# Altium project TractiveSystem.PrjPcb
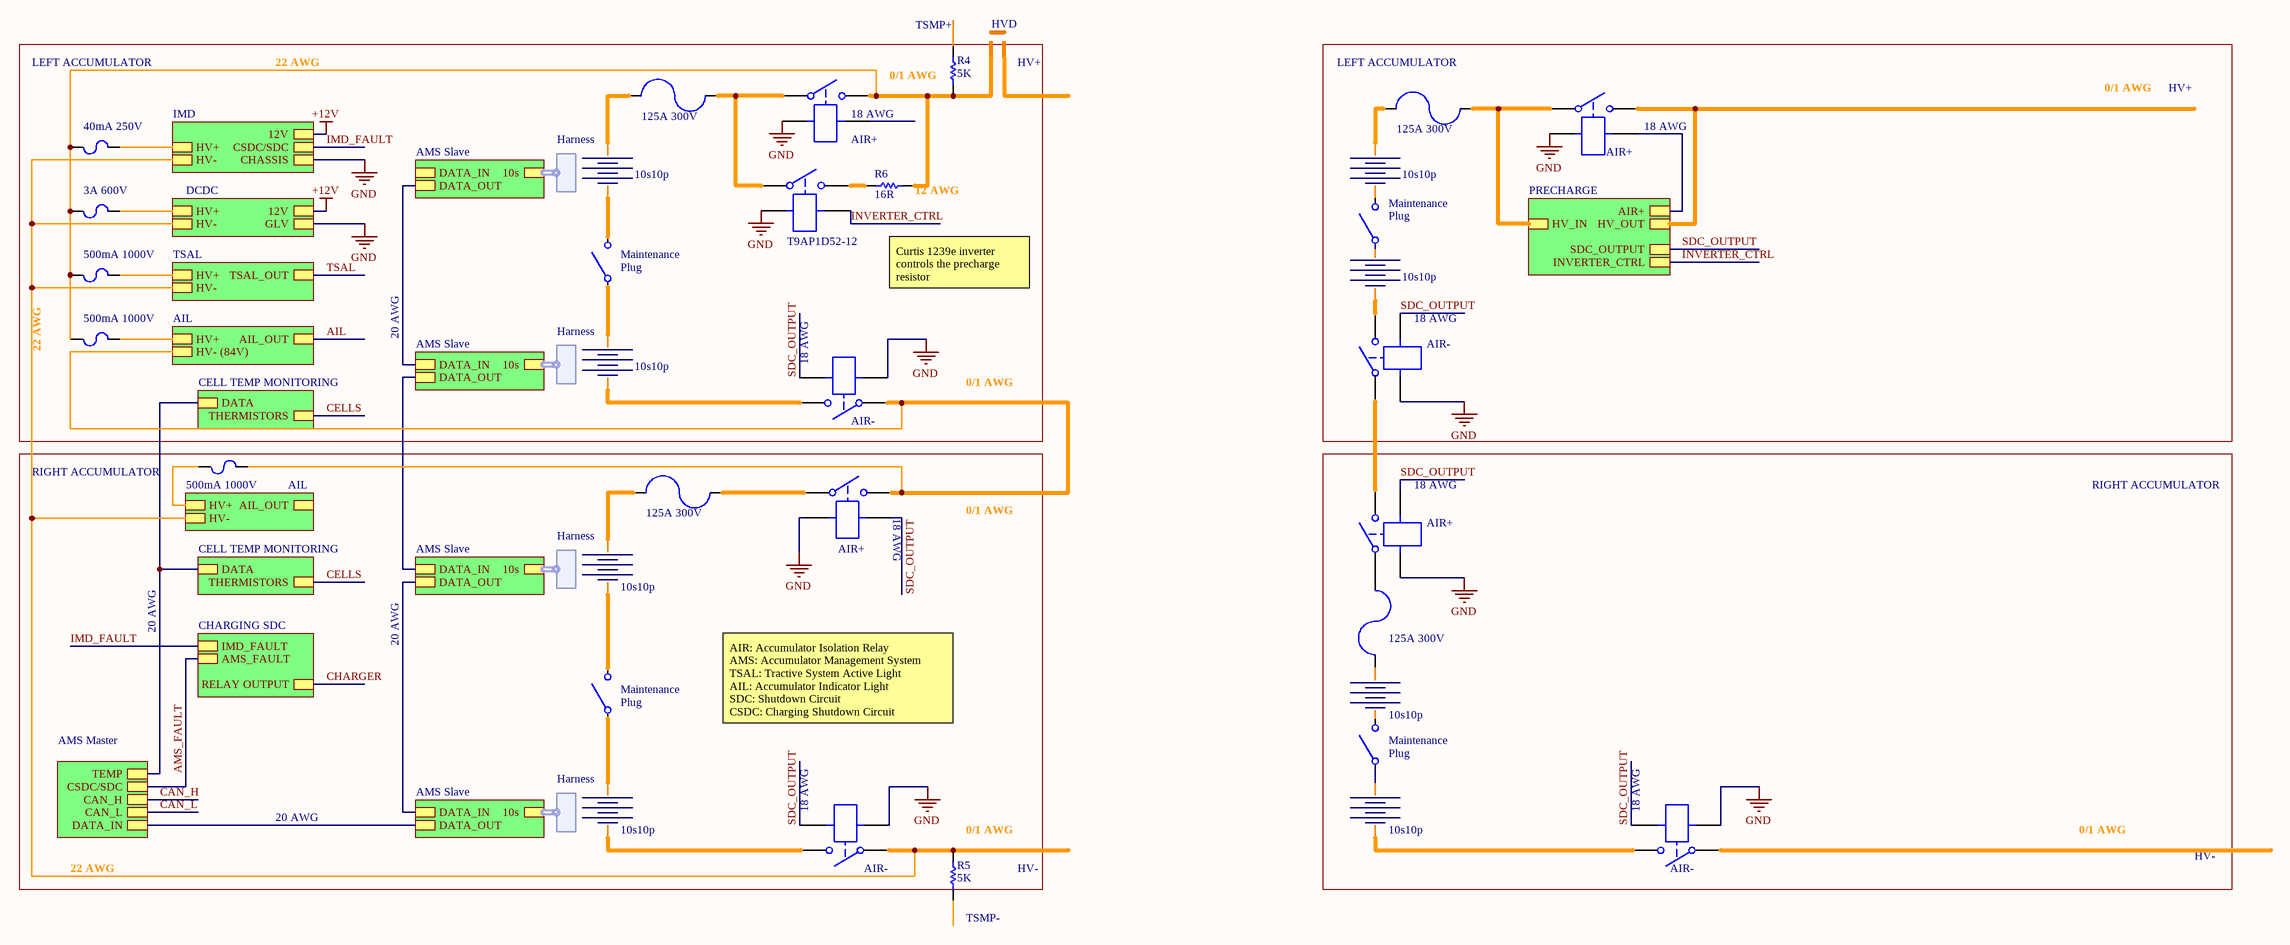
[diagram p0: Accumulator_Overview.SchDoc]
8 sheets, 70 parts. Net scope: hierarchical (ports join the sheet entries above them; power ports are global).
Sheets:
  Accumulator_Overview.SchDoc
  ChargingTS.SchDoc
  HVSystem.SchDoc
  FullSystem.SchDoc
    Designator = BatteryBoxLeft.SchDoc
    Designator = LowVoltageBox.SchDoc
    Designator = Dashboard.SchDoc
    Designator = BatteryBoxRight.SchDoc

## Sheet Accumulator_Overview.SchDoc
size A1

### Parts
(Parts that share a designator on the sheet are numbered #1, #2 ... from top to bottom, then left to right.)
1  125A 300V
2  125A 300V
3  AIR+
3A_600V  3A 600V
4  10s10p
5  125A 300V
6  AIR+
7  125A 300V
8  10s10p
9  10s10p
10s10p  10s10p
18  10s10p
19  10s10p
45  AIR-
*1  T9AP1D52-12
*2  500mA 1000V
*3  AIR+
*4  AIR-
*5  HVD
*6  AIR+
*7  AIR-
*8  AIR-
*9  40mA 250V
*10  500mA 1000V
*#1  500mA 1000V
Battery2  10s10p
Battery#1  10s10p
Plug  Maintenance_Plug  (value not drawn)
Plug1  Maintenance_Plug  (value not drawn)
Plug2  Maintenance_Plug  (value not drawn)
Plug3  Maintenance_Plug  (value not drawn)
R4  5K
R5  5K
R6  16R

### Sub-sheets
AIL = File Name (file not in this document): HV+, HV- (84V), AIL_OUT
AIL = File Name (file not in this document): HV+, HV-, AIL_OUT
AMS Master = File Name (file not in this document): CAN_H, DATA_IN, CAN_L, CSDC/SDC, TEMP
AMS Slave = File Name (file not in this document): 10s (harness Harness), DATA_OUT, DATA_IN
AMS Slave = File Name (file not in this document): 10s (harness Harness), DATA_OUT, DATA_IN
AMS Slave = File Name (file not in this document): 10s (harness Harness), DATA_OUT, DATA_IN
AMS Slave = File Name (file not in this document): 10s (harness Harness), DATA_OUT, DATA_IN
CELL TEMP MONITORING = File Name (file not in this document): THERMISTORS, DATA
CELL TEMP MONITORING = File Name (file not in this document): THERMISTORS, DATA
CHARGING SDC = File Name (file not in this document): RELAY OUTPUT, IMD_FAULT, AMS_FAULT
DCDC = File Name (file not in this document): HV+, HV-, 12V, GLV
IMD = File Name (file not in this document): HV+, HV-, 12V, CHASSIS, CSDC/SDC
PRECHARGE = File Name (file not in this document): SDC_OUTPUT, HV_IN, HV_OUT, INVERTER_CTRL, AIR+
TSAL = File Name (file not in this document): HV+, HV-, TSAL_OUT

### Harnesses
Harness: 

### Nets
+12V: sheet IMD/12V, sheet DCDC/12V
GND: 3.4 6.4 45.4 *1.4 *3.4 *4.4 *6.4 *7.4 *8.4 ; sheet IMD/CHASSIS, sheet DCDC/GLV
AIL: sheet AIL/AIL_OUT
AMS_FAULT: sheet AMS Master/CSDC/SDC, sheet CHARGING SDC/AMS_FAULT
CAN_H: sheet AMS Master/CAN_H
CAN_L: sheet AMS Master/CAN_L
CELLS: sheet CELL TEMP MONITORING/THERMISTORS, sheet CELL TEMP MONITORING/THERMISTORS
CHARGER: sheet CHARGING SDC/RELAY OUTPUT
IMD_FAULT: sheet IMD/CSDC/SDC, sheet CHARGING SDC/IMD_FAULT
INVERTER_CTRL: *1.4 ; sheet PRECHARGE/INVERTER_CTRL
SDC_OUTPUT: 3.4 6.4 45.4 *4.4 *7.4 *8.4 ; sheet PRECHARGE/SDC_OUTPUT
TSAL: sheet TSAL/TSAL_OUT
Net1_1: 1.1 Battery#1.1
Net1_2: 1.2 *1.4 *3.4
Net2_1: 2.1 Battery2.1
Net2_2: 2.2 *6.4 ; sheet PRECHARGE/HV_IN
Net3_4: 3.4 5.2
Net3_4: 3.4 45.4 *10.2 ; sheet AIL/HV- (84V)  [a separate net that carries the same name]
Net3A_600V_1: 3A_600V.1 *2.1 *3.4 *9.1 *#1.1 R4.1 R6.1
Net3A_600V_2: 3A_600V.2 ; sheet DCDC/HV+
Net4_1: 4.1 Plug2.4
Net4_2: 4.2 *7.4
Net5_1: 5.1 10s10p.1
Net6_4: 6.4 7.2
Net6_4: 6.4 *7.4  [a separate net that carries the same name]
Net7_1: 7.1 8.1
Net9_1: 9.1 Plug3.4
Net9_2: 9.2 *8.4
Net10s10p_2: 10s10p.2 Plug.4
Net18_1: 18.1 Plug.4
Net18_2: 18.2 *4.4
Net19_1: 19.1 Plug1.4
Net19_2: 19.2 45.4
Net*2_2: *2.2 ; sheet AIL/HV+
Net*4_4: *4.4 R5.2 ; sheet IMD/HV-, sheet DCDC/HV-, sheet TSAL/HV-, sheet AIL/HV-
Net*6_4: *6.4 ; sheet PRECHARGE/HV_OUT
Net*6_4: *6.4 ; sheet PRECHARGE/AIR+  [a separate net that carries the same name]
Net*9_2: *9.2 ; sheet IMD/HV+
Net*10_1: *10.1 ; sheet AIL/HV+
Net*#1_2: *#1.2 ; sheet TSAL/HV+
NetBattery2_2: Battery2.2 Plug2.4
NetBattery#1_2: Battery#1.2 Plug1.4
(unnamed): sheet AMS Master/DATA_IN, sheet AMS Slave/DATA_OUT
(unnamed): sheet AMS Master/TEMP, sheet CELL TEMP MONITORING/DATA, sheet CELL TEMP MONITORING/DATA
(unnamed): sheet AMS Slave/DATA_IN, sheet AMS Slave/DATA_OUT
(unnamed): sheet AMS Slave/DATA_IN, sheet AMS Slave/DATA_OUT
(unnamed): sheet AMS Slave/DATA_IN, sheet AMS Slave/DATA_OUT

Not connected (* = marked no-connect by the designer): 8 2; R4 2; R5 1; R6 2

### Notes on the sheet
- LEFT ACCUMULATOR
- 22 AWG
- (near R4) 0/1 AWG
- (near R4) TSMP+
- (near *5) HV+
- (near 2) LEFT ACCUMULATOR
- (near *3) 18 AWG
- (near *6) 18 AWG
- 0/1 AWG
- HV+
- (near R6) 12 AWG
- Maintenance
- (near Plug1) Maintenance
- (near Plug1) Plug
- (near Plug2) Plug
- 20 AWG
- Curtis 1239e inverter controls the precharge resistor
- (near *7) 18 AWG
- (near 45) 18 AWG
- RIGHT ACCUMULATOR
- (near 3) 18 AWG
- (near 6) 18 AWG
- (near Plug) Maintenance
- (near Plug) Plug
- AIR: Accumulator Isolation Relay
  AMS: Accumulator Management System
  TSAL: Tractive System Active Light
  AIL: Accumulator Indicator Light
  SDC: Shutdown Circuit
  CSDC: Charging Shutdown Circuit
- (near Plug3) Maintenance
- (near Plug3) Plug
- (near *4) 18 AWG
- (near R5) 0/1 AWG
- (near *8) 18 AWG
- HV-
- (near R5) TSMP-

### Library data of the parts
1 2 5 7 = FUSE
3 6 45 *1 *3 *4 *6-*8 = AIR_Detailed
3A_600V *2 *9 *10 *#1 = FUSE_MINI
4 8 9 10s10p 18 19 Battery2 Battery#1 = Battery
R4-R6 = RES

## Sheet ChargingTS.SchDoc
size A4
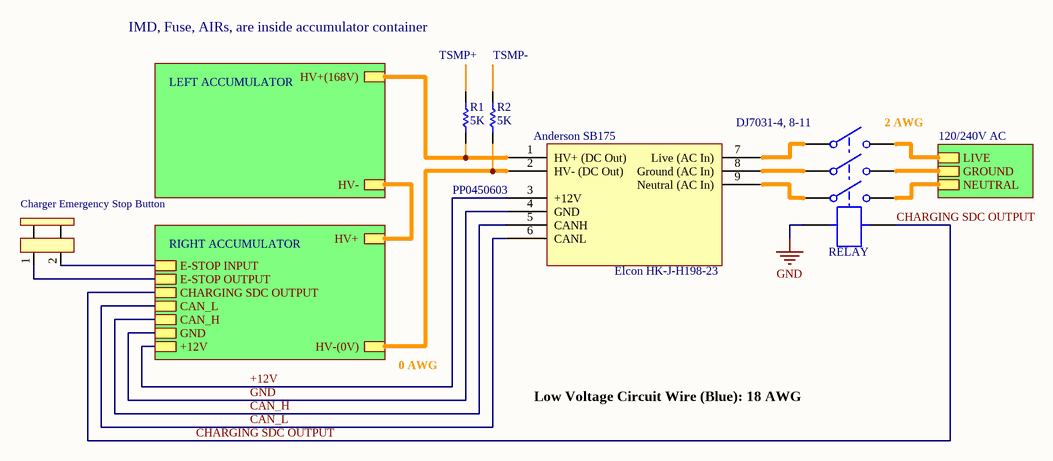
[diagram p1: ChargingTS.SchDoc]

### Parts
(Parts that share a designator on the sheet are numbered #1, #2 ... from top to bottom, then left to right.)
11  RELAY
*#2  SDCbutton  (value not drawn)
?#1  Elcon HK-J-H198-23
R1#1  5K
R2#1  5K

### Sub-sheets
LEFT ACCUMULATOR = File Name (file not in this document): HV+(168V), HV-
RIGHT ACCUMULATOR = File Name (file not in this document): CAN_H, CAN_L, HV-(0V), HV+, +12V, GND, CHARGING SDC OUTPUT, E-STOP INPUT, E-STOP OUTPUT
? = 120/240V AC (file not in this document): LIVE, GROUND, NEUTRAL

### Nets
GND: 11.4 ?#1.4(GND) ; sheet RIGHT ACCUMULATOR/GND
+12V: ?#1.3(+12V) ; sheet RIGHT ACCUMULATOR/+12V
CAN_H: ?#1.5(CANH) ; sheet RIGHT ACCUMULATOR/CAN_H
CAN_L: ?#1.6(CANL) ; sheet RIGHT ACCUMULATOR/CAN_L
CHARGING SDC OUTPUT: 11.4 ; sheet RIGHT ACCUMULATOR/CHARGING SDC OUTPUT
Net11_4: 11.4 ?#1.7(Live_(AC_In))
Net11_4: 11.4 ?#1.8(Ground_(AC_In))  [a separate net that carries the same name]
Net11_4: 11.4 ?#1.9(Neutral_(AC_In))  [a separate net that carries the same name]
Net11_4: 11.4 ; sheet /NEUTRAL  [a separate net that carries the same name]
Net11_4: 11.4 ; sheet /GROUND  [a separate net that carries the same name]
Net11_4: 11.4 ; sheet /LIVE  [a separate net that carries the same name]
Net*#2_1: *#2.1 ; sheet RIGHT ACCUMULATOR/E-STOP OUTPUT
Net*#2_2: *#2.2 ; sheet RIGHT ACCUMULATOR/E-STOP INPUT
Net?#1_1: ?#1.1(HV+_(DC_Out)) R1#1.1 ; sheet LEFT ACCUMULATOR/HV+(168V)
Net?#1_2: ?#1.2(HV-_(DC_Out)) R2#1.1 ; sheet RIGHT ACCUMULATOR/HV-(0V)
(unnamed): sheet LEFT ACCUMULATOR/HV-, sheet RIGHT ACCUMULATOR/HV+

Not connected (* = marked no-connect by the designer): R1#1 2; R2#1 2

### Notes on the sheet
- IMD, Fuse, AIRs, are inside accumulator container
- TSMP+
- TSMP-
- (near R2#1) Anderson SB175
- (near 11) DJ7031-4, 8-11
- (near 11) 2 AWG
- PP0450603
- 0 AWG
- Low Voltage Circuit Wire (Blue): 18 AWG
- (in symbol SDCbutton) Charger Emergency Stop Button

### Library data of the parts
?#1 = Charger
R1#1 R2#1 = RES

## Sheet HVSystem.SchDoc
size A4
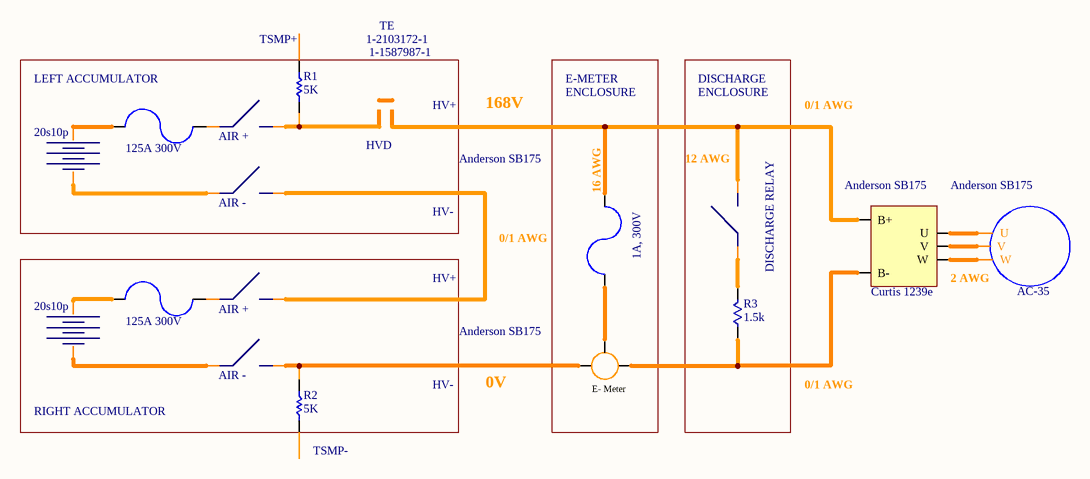
[diagram p2: HVSystem.SchDoc]

### Parts
(Parts that share a designator on the sheet are numbered #1, #2 ... from top to bottom, then left to right.)
125A_300V  125A 300V
*#3  HVD
?#2  1A, 300V
?#3  125A 300V
AIR+  AIR +
AIR+1  AIR -
AIR+2  DISCHARGE RELAY
AIR-  AIR -
AIR-1  AIR +
battery1  20s10p
battery#2  20s10p
inverter  Curtis 1239e
meter  E-meter  (value not drawn)
motor  AC-35
R1#2  5K
R2#2  5K
R3  1.5k

### Nets
Net125A_300V_1: 125A_300V.1 battery#2.1
Net125A_300V_2: 125A_300V.2 AIR+.1
Net?#2_1: ?#2.1 meter.?3
Net?#2_2: ?#2.2 AIR+2.2 inverter.2(B+)
Net?#3_1: ?#3.1 battery1.1
Net?#3_2: ?#3.2 AIR-1.1
NetAIR+1_1: AIR+1.1 battery#2.2
NetAIR+1_2: AIR+1.2 AIR-1.2
NetAIR+2_1: AIR+2.1 R3.2
NetAIR+_2: AIR+.2 R1#2.1
NetAIR-_1: AIR-.1 battery1.2
NetAIR-_2: AIR-.2 meter.?1 R2#2.2
Netinverter_1: inverter.1(B-) meter.?2 R3.1
Netinverter_3: inverter.3(U) motor.3(U)
Netinverter_4: inverter.4(V) motor.4(V)
Netinverter_5: inverter.5(W) motor.5(W)

Not connected (* = marked no-connect by the designer): R1#2 2; R2#2 1

### Notes on the sheet
- (near R1#2) TSMP+
- 1-2103172-1
- (near *#3) 1-1587987-1
- TE
- LEFT ACCUMULATOR
- (near *#3) HV+
- 168V
- E-METER
- ENCLOSURE
- DISCHARGE
- 0/1 AWG
- Anderson SB175
- (near ?#2) 16 AWG
- (near AIR+2) 12 AWG
- (near inverter) Anderson SB175
- HV-
- HV+
- (near meter) Anderson SB175
- 2 AWG
- RIGHT ACCUMULATOR
- 0V
- (near R2#2) TSMP-
- (in symbol E-meter) E- Meter /

### Library data of the parts
125A_300V ?#2 ?#3 = FUSE
AIR+ AIR+1 AIR+2 AIR- AIR-1 = AIR
battery1 battery#2 = Battery
inverter = Inverter
motor = Motor
R1#2 R2#2 = RES
R3 = Resistor

## Sheet FullSystem.SchDoc
size A1
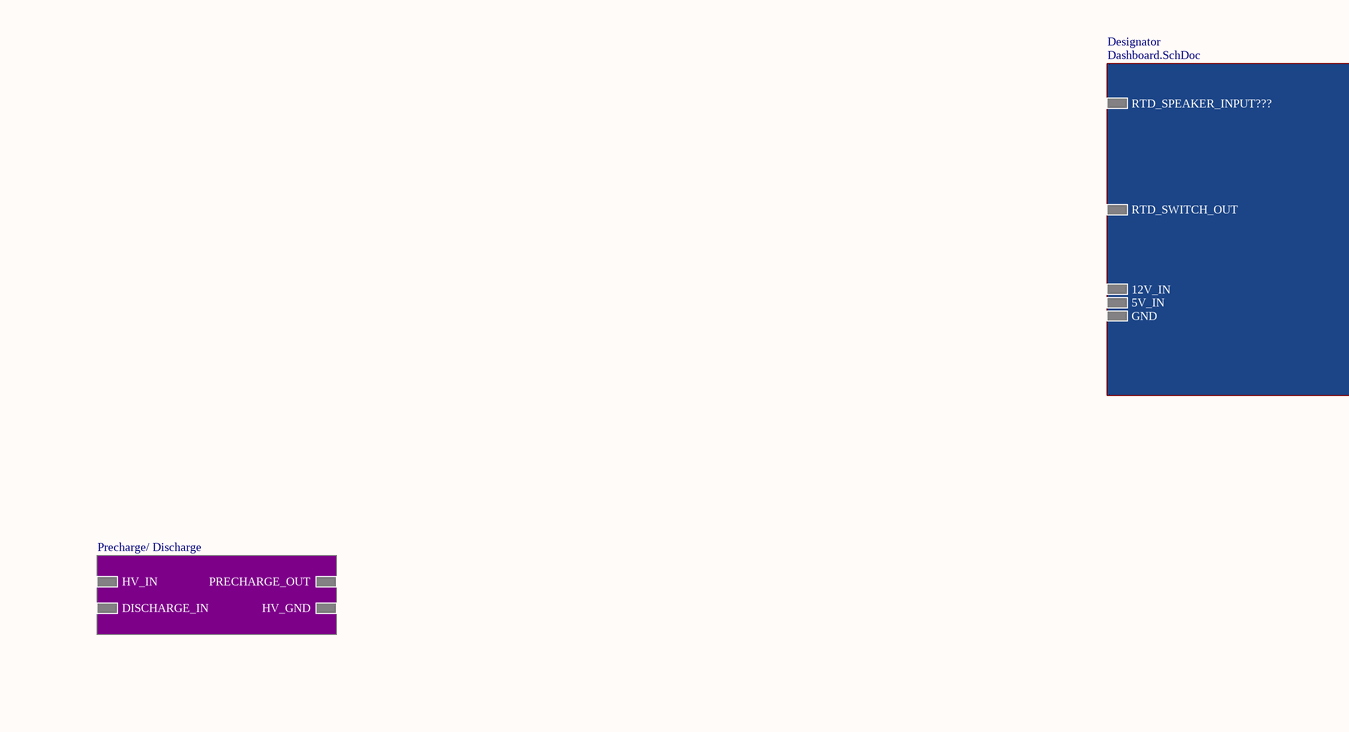
[diagram p3: FullSystem.SchDoc, top left]
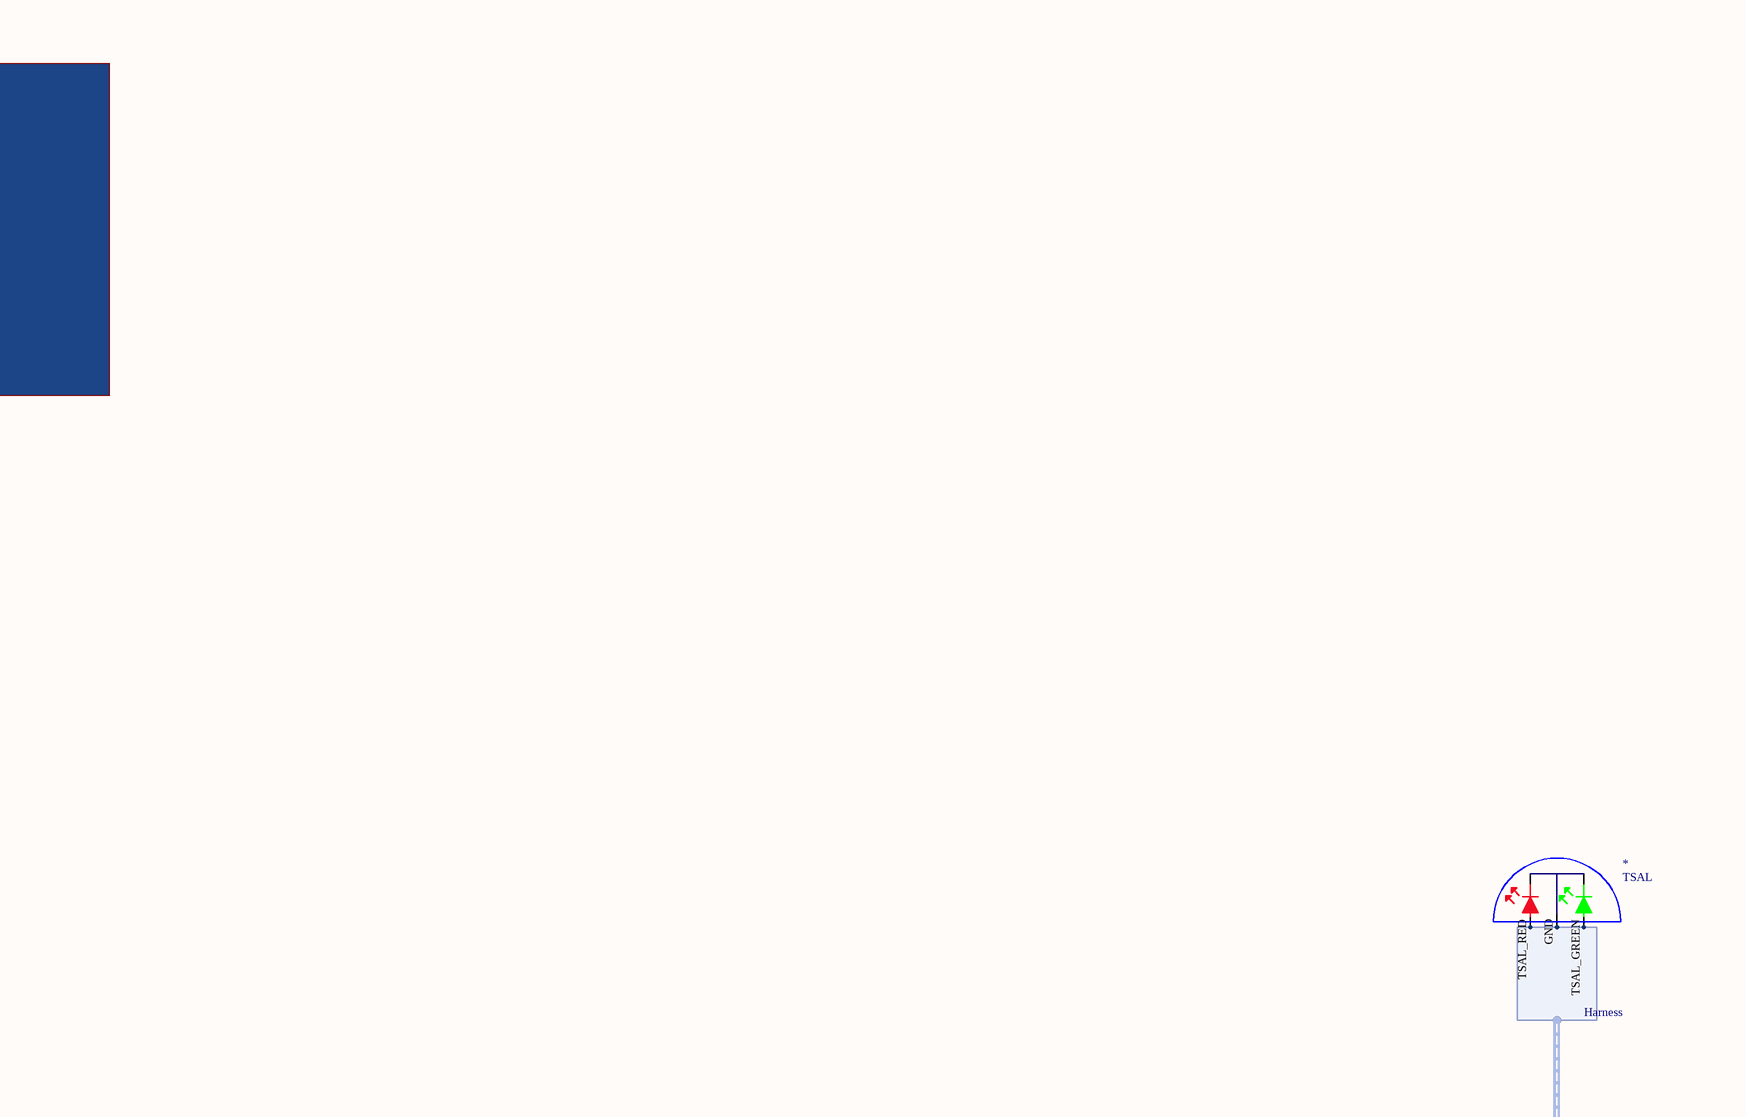
[diagram p4: FullSystem.SchDoc, top right]
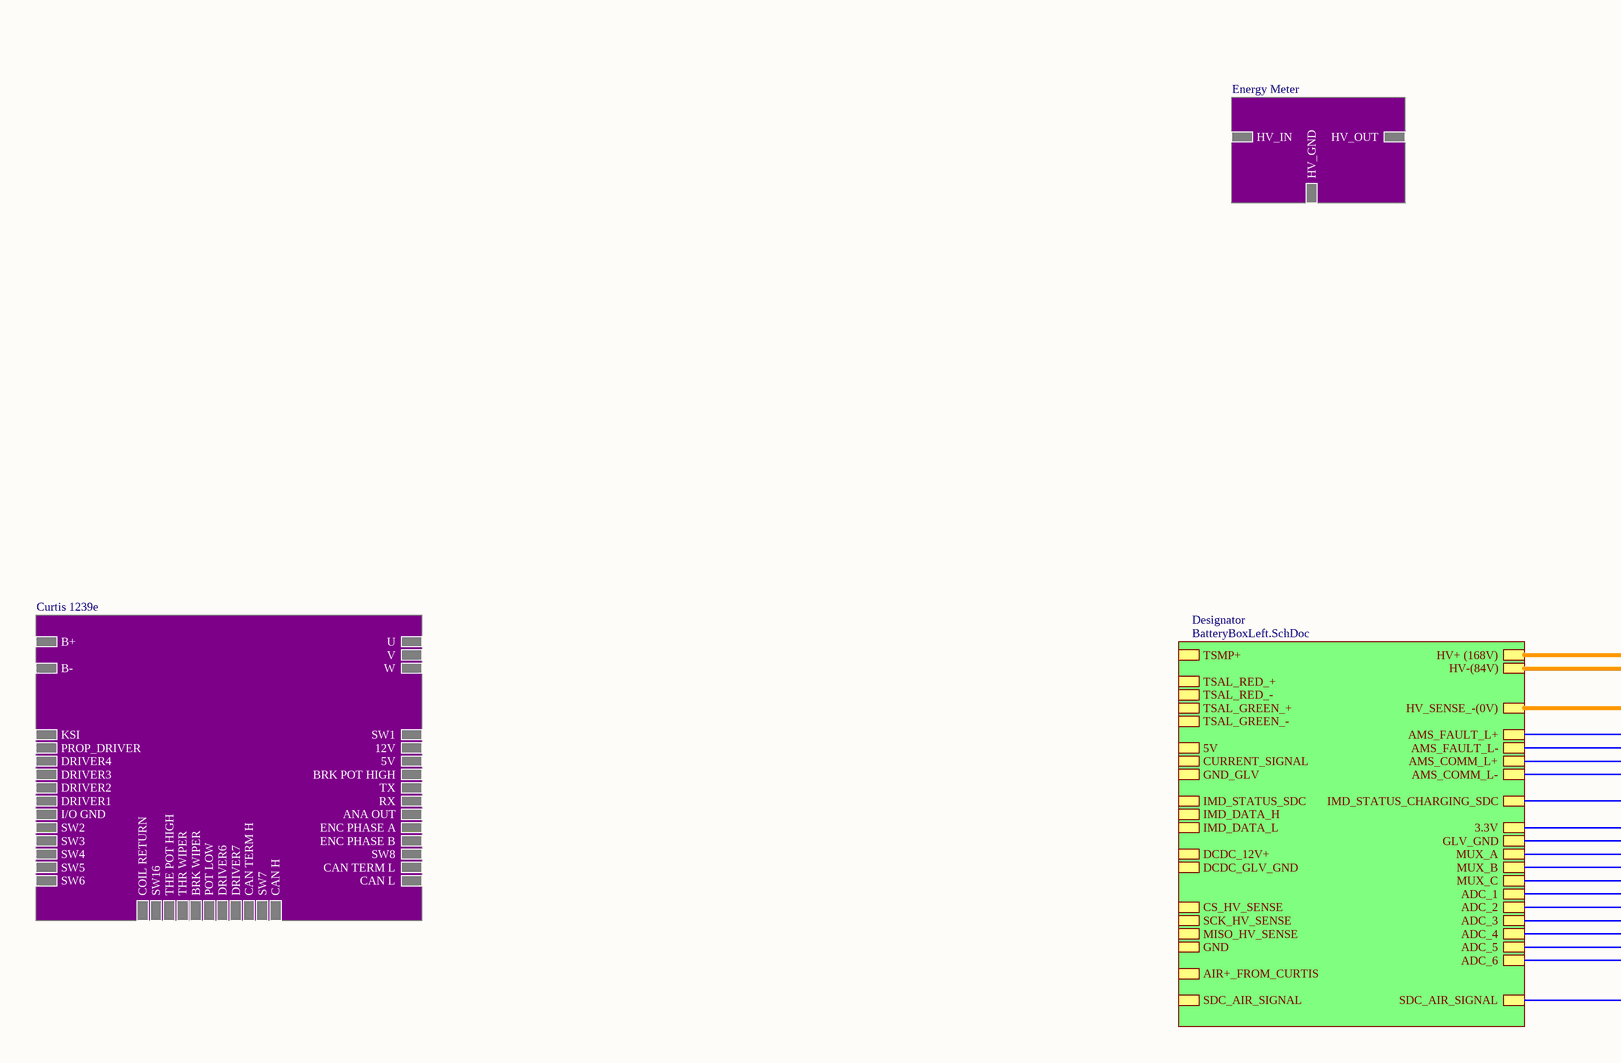
[diagram p5: FullSystem.SchDoc, bottom left]
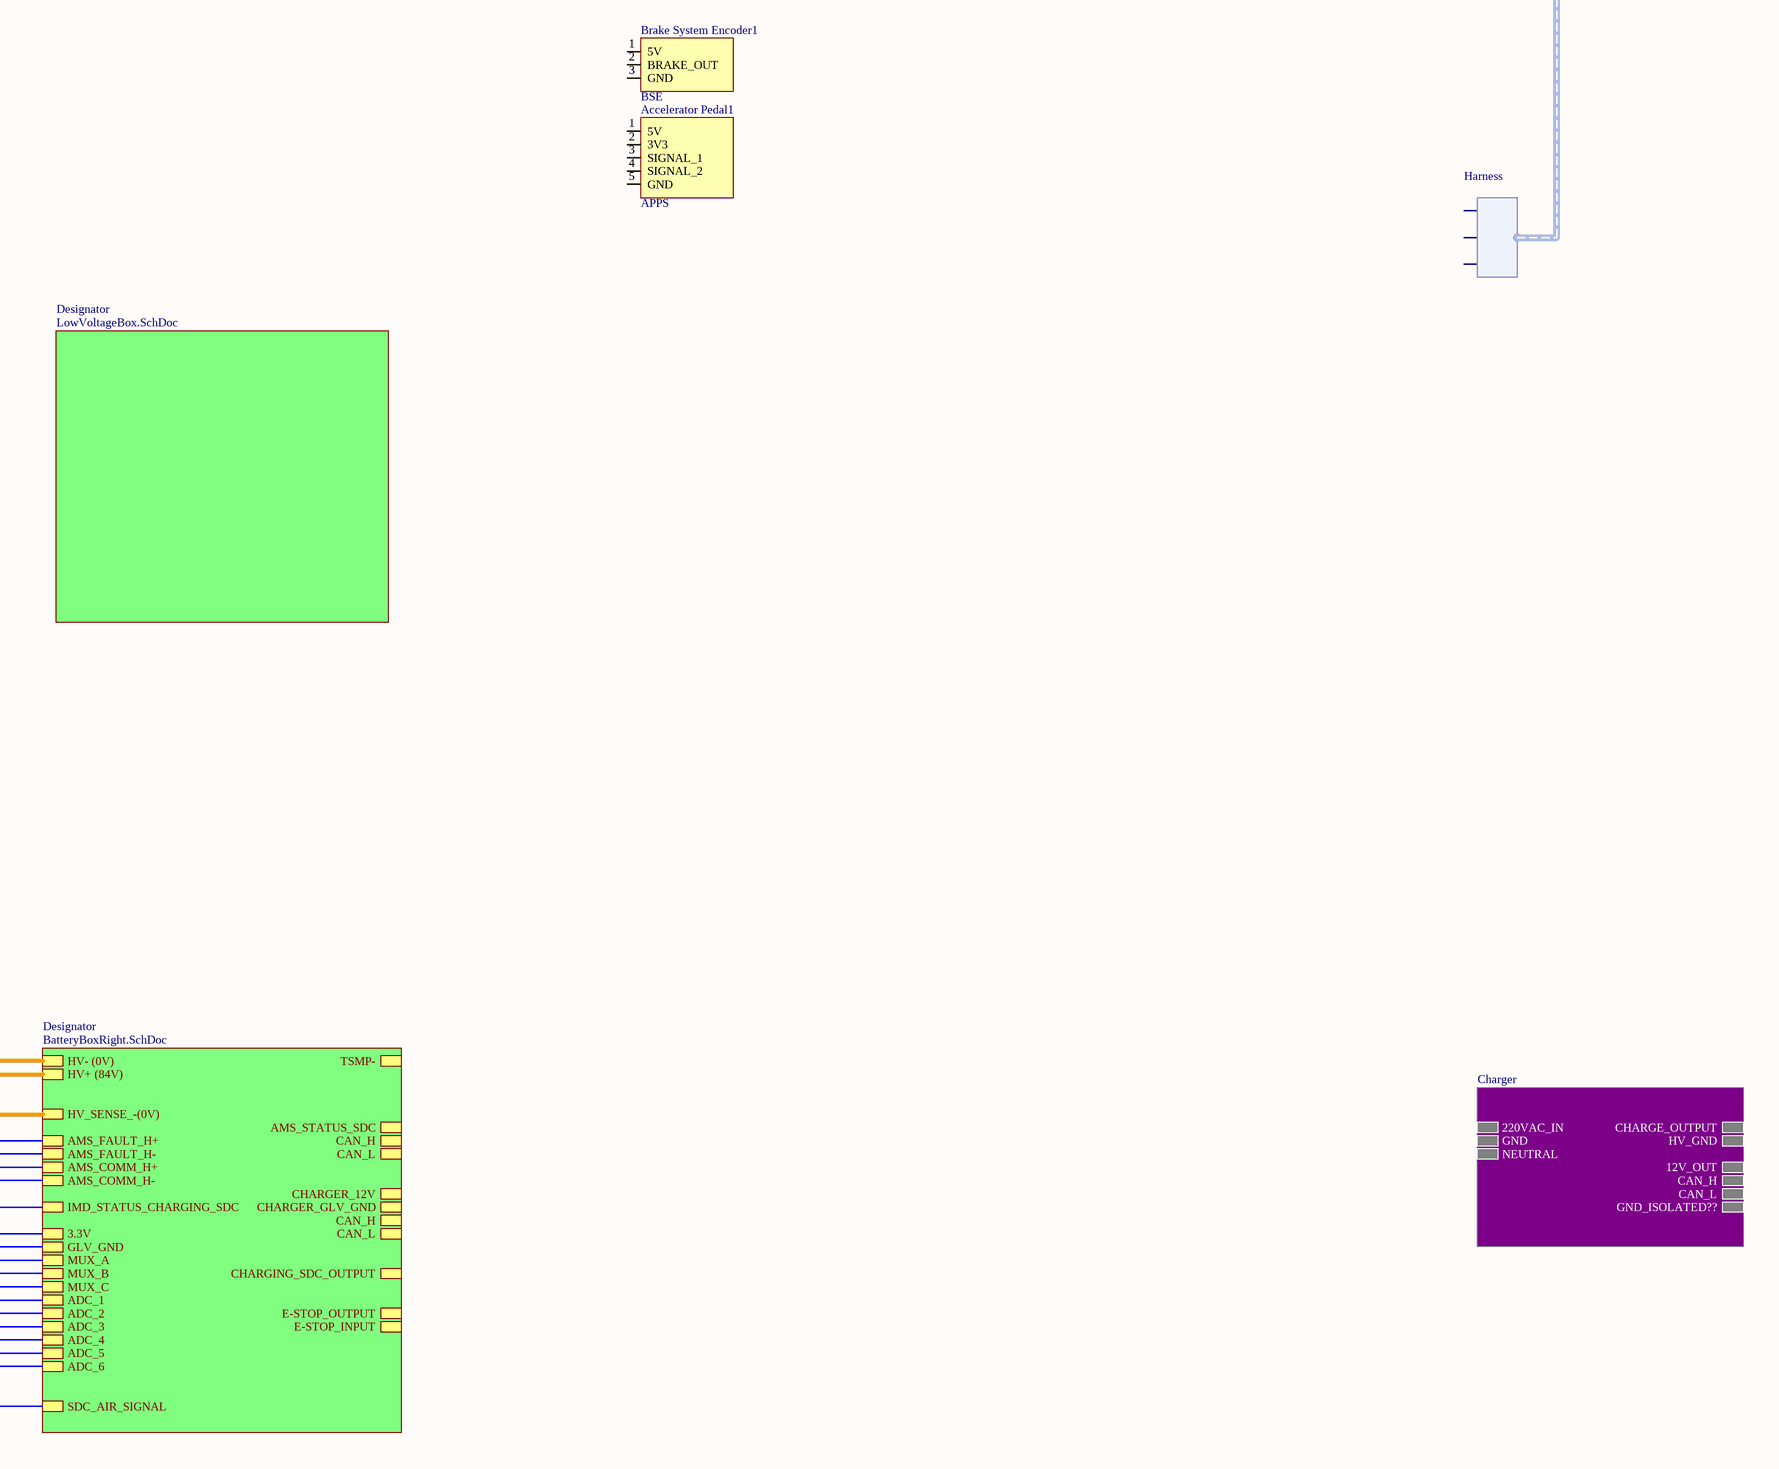
[diagram p6: FullSystem.SchDoc, bottom right]

### Parts
(Parts that share a designator on the sheet are numbered #1, #2 ... from top to bottom, then left to right.)
*#4  TSAL
Accelerator_Pedal1  APPS
Brake_System_Encoder1  BSE

### Sub-sheets
Charger = ?: 220VAC_IN, NEUTRAL, CHARGE_OUTPUT, 12V_OUT, CAN_H, CAN_L, GND_ISOLATED??, HV_GND, GND
Curtis 1239e = ?: B+, B-, U, V, W, DRIVER4, DRIVER3, DRIVER2, DRIVER1, I/O GND, SW2, SW3, SW4, SW5, SW6, COIL RETURN, SW16, THE POT HIGH, THR WIPER, BRK WIPER, POT LOW, DRIVER6, DRIVER7, CAN TERM H, SW7, CAN H, BRK POT HIGH, SW8, ENC PHASE B, ENC PHASE A, ANA OUT, RX, TX, 5V, PROP_DRIVER, 12V, KSI, SW1, CAN TERM L, CAN L
Designator = BatteryBoxLeft.SchDoc: HV+ (168V), HV-(84V), AMS_FAULT_L+, AMS_FAULT_L-, AMS_COMM_L+, AMS_COMM_L-, 3.3V, GLV_GND, MUX_A, MUX_B, MUX_C, ADC_1, ADC_2, ADC_3, ADC_4, ADC_5, ADC_6, 5V, CURRENT_SIGNAL, GND_GLV, IMD_STATUS_SDC, IMD_DATA_H, IMD_DATA_L, DCDC_12V+, DCDC_GLV_GND, TSMP+, IMD_STATUS_CHARGING_SDC, MISO_HV_SENSE, SCK_HV_SENSE, CS_HV_SENSE, HV_SENSE_-(0V), SDC_AIR_SIGNAL, SDC_AIR_SIGNAL, AIR+_FROM_CURTIS, TSAL_RED_+, TSAL_RED_-, TSAL_GREEN_+, TSAL_GREEN_-, GND
Designator = LowVoltageBox.SchDoc: no entries
Designator = Dashboard.SchDoc: RTD_SPEAKER_INPUT???, RTD_SWITCH_OUT, 12V_IN, 5V_IN, GND
Designator = BatteryBoxRight.SchDoc: HV- (0V), HV+ (84V), AMS_FAULT_H+, AMS_FAULT_H-, AMS_COMM_H+, AMS_COMM_H-, CAN_H, CAN_L, 3.3V, GLV_GND, MUX_A, MUX_B, MUX_C, ADC_1, ADC_2, ADC_3, ADC_4, ADC_5, ADC_6, TSMP-, IMD_STATUS_CHARGING_SDC, HV_SENSE_-(0V), CHARGER_12V, CHARGER_GLV_GND, CHARGING_SDC_OUTPUT, AMS_STATUS_SDC, SDC_AIR_SIGNAL, E-STOP_INPUT, E-STOP_OUTPUT, CAN_H, CAN_L
Energy Meter = ?: HV_IN, HV_GND, HV_OUT
Precharge/ Discharge = ?: HV_IN, DISCHARGE_IN, PRECHARGE_OUT, HV_GND

### Harnesses
Harness: , , 
Harness: 

### Nets
Net*#4_GND: *#4.GND *#4.TSAL_GREEN *#4.TSAL_RED ; harness Harness.
(unnamed): sheet Designator/HV-(84V), sheet Designator/HV+ (84V)
(unnamed): sheet Designator/AMS_FAULT_L+, sheet Designator/AMS_FAULT_H+
(unnamed): sheet Designator/AMS_FAULT_L-, sheet Designator/AMS_FAULT_H-
(unnamed): sheet Designator/AMS_COMM_L+, sheet Designator/AMS_COMM_H+
(unnamed): sheet Designator/AMS_COMM_L-, sheet Designator/AMS_COMM_H-
(unnamed): sheet Designator/3.3V, sheet Designator/3.3V
(unnamed): sheet Designator/GLV_GND, sheet Designator/GLV_GND
(unnamed): sheet Designator/MUX_A, sheet Designator/MUX_A
(unnamed): sheet Designator/MUX_B, sheet Designator/MUX_B
(unnamed): sheet Designator/MUX_C, sheet Designator/MUX_C
(unnamed): sheet Designator/ADC_1, sheet Designator/ADC_1
(unnamed): sheet Designator/ADC_2, sheet Designator/ADC_2
(unnamed): sheet Designator/ADC_3, sheet Designator/ADC_3
(unnamed): sheet Designator/ADC_4, sheet Designator/ADC_4
(unnamed): sheet Designator/ADC_5, sheet Designator/ADC_5
(unnamed): sheet Designator/ADC_6, sheet Designator/ADC_6
(unnamed): sheet Designator/IMD_STATUS_CHARGING_SDC, sheet Designator/IMD_STATUS_CHARGING_SDC
(unnamed): sheet Designator/HV_SENSE_-(0V), sheet Designator/HV_SENSE_-(0V)
(unnamed): sheet Designator/SDC_AIR_SIGNAL, sheet Designator/SDC_AIR_SIGNAL, sheet Designator/SDC_AIR_SIGNAL
(unnamed): sheet Designator/CAN_H, sheet Designator/CAN_H
(unnamed): sheet Designator/CAN_L, sheet Designator/CAN_L

Not connected (* = marked no-connect by the designer): *#4 2; Accelerator_Pedal1 1(5V) 2(3V3) 3(SIGNAL_1) 4(SIGNAL_2) 5(GND); Brake_System_Encoder1 1(5V) 2(BRAKE_OUT) 3(GND)

## Sheet BatteryBoxLeft.SchDoc
size A1
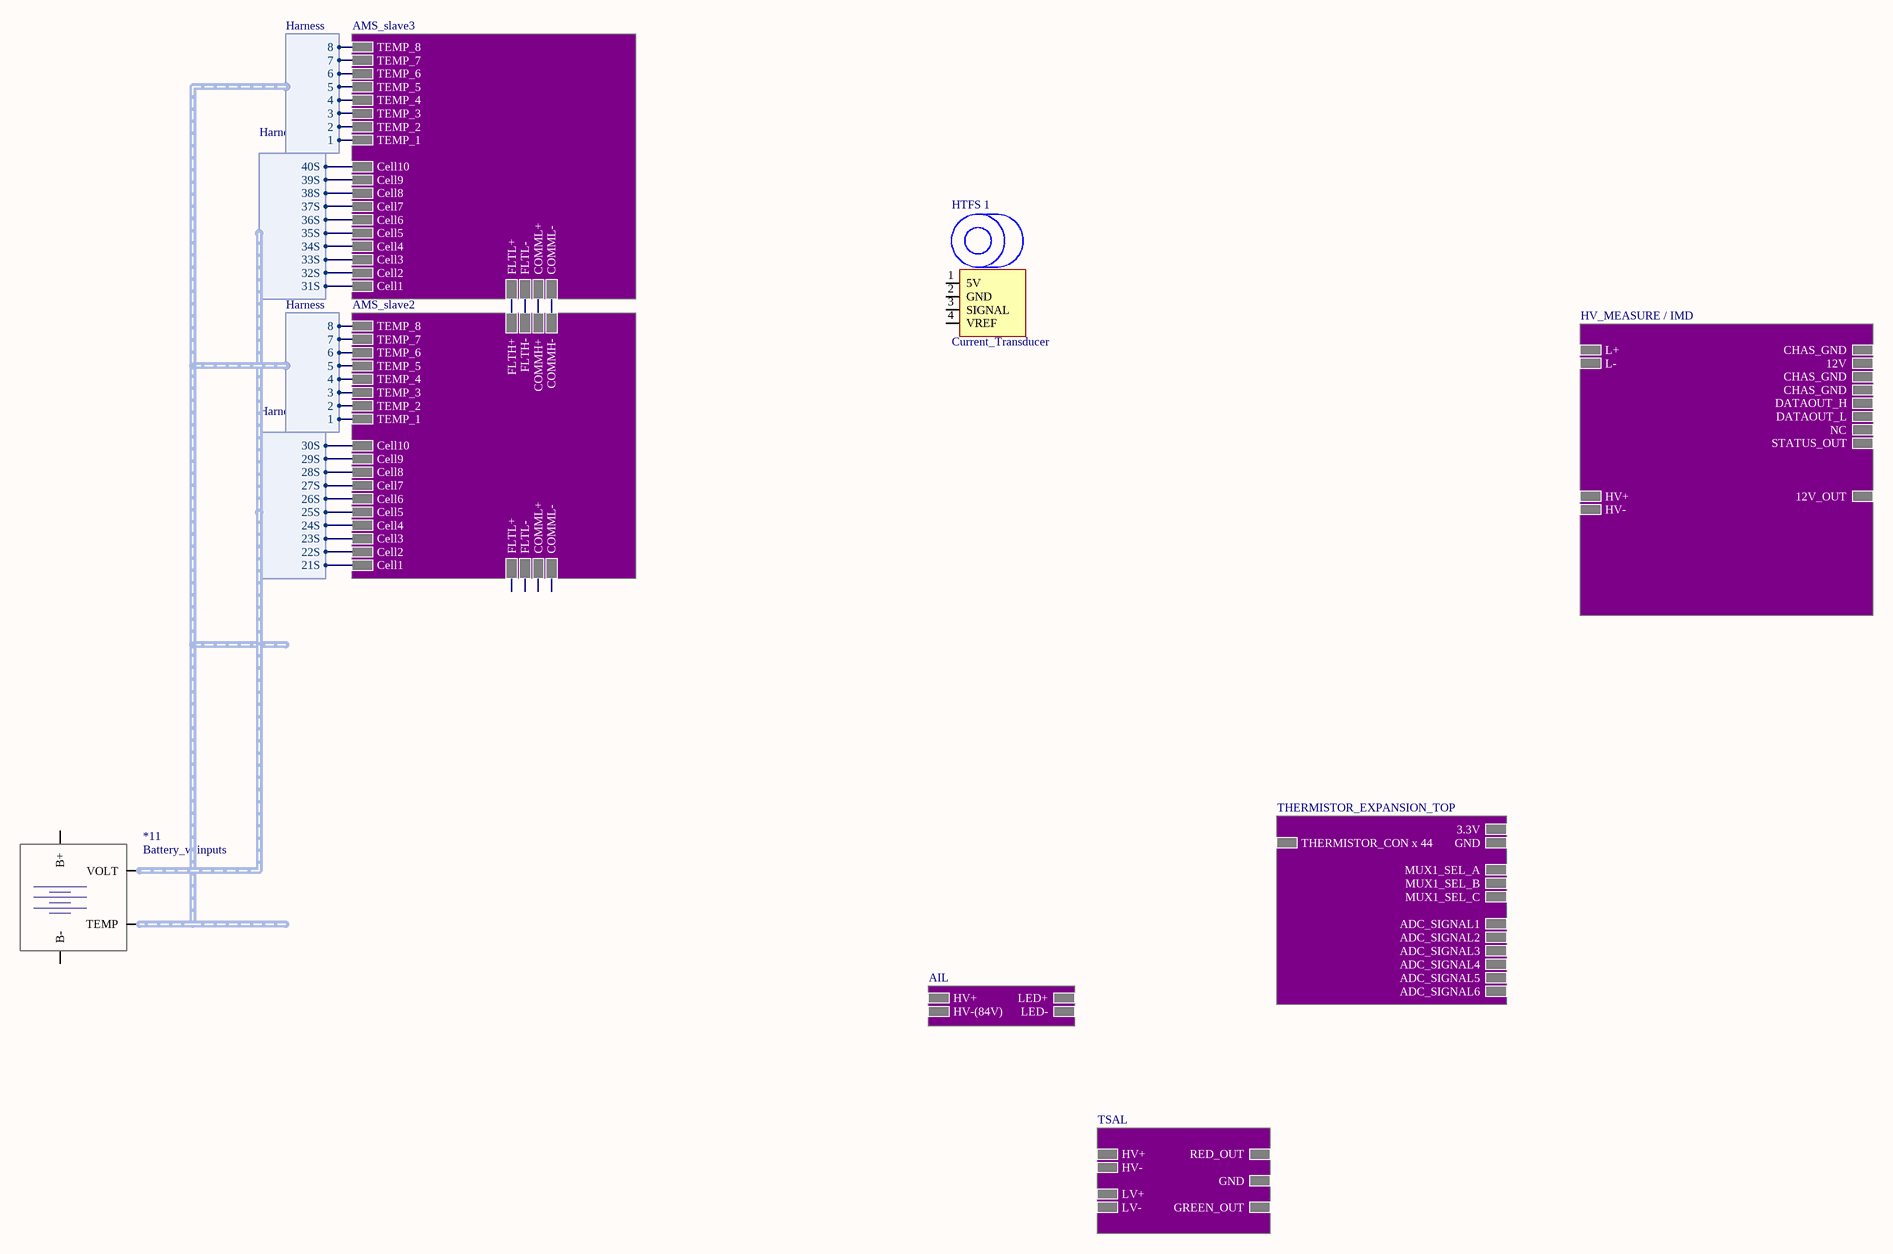
[diagram p7: BatteryBoxLeft.SchDoc]

### Parts
*11  Battery_w/inputs
HTFS_1  Current_Transducer

### Sub-sheets
AIL = ?: HV+, HV-(84V), LED+, LED-
AMS_slave2 = ?: Cell10, Cell9, Cell8, Cell7, Cell6, Cell5, Cell4, Cell3, Cell2, Cell1, FLTH+, FLTH-, COMMH+, COMMH-, FLTL+, FLTL-, COMML+, COMML-, TEMP_1, TEMP_3, TEMP_4, TEMP_5, TEMP_6, TEMP_7, TEMP_8, TEMP_2
AMS_slave3 = ?: Cell10, Cell9, Cell8, Cell7, Cell6, Cell5, Cell4, Cell3, Cell2, Cell1, FLTL+, FLTL-, COMML+, COMML-, TEMP_1, TEMP_3, TEMP_4, TEMP_5, TEMP_6, TEMP_7, TEMP_8, TEMP_2
HV_MEASURE / IMD = ?: L+, L-, CHAS_GND, 12V, CHAS_GND, CHAS_GND, DATAOUT_H, DATAOUT_L, NC, STATUS_OUT, HV+, HV-, 12V_OUT
THERMISTOR_EXPANSION_TOP = ?: 3.3V, GND, MUX1_SEL_A, MUX1_SEL_B, MUX1_SEL_C, ADC_SIGNAL2, ADC_SIGNAL3, ADC_SIGNAL4, THERMISTOR_CON x 44, ADC_SIGNAL1, ADC_SIGNAL5, ADC_SIGNAL6
TSAL = ?: HV+, HV-, LV+, LV-, RED_OUT, GND, GREEN_OUT

### Harnesses
Harness: 30S, 29S, 28S, 27S, 26S, 25S, 24S, 23S, 22S, 21S
Harness: 40S, 39S, 38S, 37S, 36S, 35S, 34S, 33S, 32S, 31S
Harness: 1, 2, 3, 4, 5, 6, 7, 8

### Nets
(unnamed): sheet AMS_slave2/Cell10, harness Harness.30S
(unnamed): sheet AMS_slave2/Cell9, harness Harness.29S
(unnamed): sheet AMS_slave2/Cell8, harness Harness.28S
(unnamed): sheet AMS_slave2/Cell7, harness Harness.27S
(unnamed): sheet AMS_slave2/Cell6, harness Harness.26S
(unnamed): sheet AMS_slave2/Cell5, harness Harness.25S
(unnamed): sheet AMS_slave2/Cell4, harness Harness.24S
(unnamed): sheet AMS_slave2/Cell3, harness Harness.23S
(unnamed): sheet AMS_slave2/Cell2, harness Harness.22S
(unnamed): sheet AMS_slave2/Cell1, harness Harness.21S
(unnamed): sheet AMS_slave2/FLTH+, sheet AMS_slave3/FLTL+
(unnamed): sheet AMS_slave2/FLTH-, sheet AMS_slave3/FLTL-
(unnamed): sheet AMS_slave2/COMMH+, sheet AMS_slave3/COMML+
(unnamed): sheet AMS_slave2/COMMH-, sheet AMS_slave3/COMML-
(unnamed): sheet AMS_slave2/TEMP_1, sheet AMS_slave3/TEMP_1, harness Harness.1
(unnamed): sheet AMS_slave2/TEMP_3, sheet AMS_slave3/TEMP_3, harness Harness.3
(unnamed): sheet AMS_slave2/TEMP_4, sheet AMS_slave3/TEMP_4, harness Harness.4
(unnamed): sheet AMS_slave2/TEMP_5, sheet AMS_slave3/TEMP_5, harness Harness.5
(unnamed): sheet AMS_slave2/TEMP_6, sheet AMS_slave3/TEMP_6, harness Harness.6
(unnamed): sheet AMS_slave2/TEMP_7, sheet AMS_slave3/TEMP_7, harness Harness.7
(unnamed): sheet AMS_slave2/TEMP_8, sheet AMS_slave3/TEMP_8, harness Harness.8
(unnamed): sheet AMS_slave2/TEMP_2, sheet AMS_slave3/TEMP_2, harness Harness.2
(unnamed): sheet AMS_slave3/Cell10, harness Harness.40S
(unnamed): sheet AMS_slave3/Cell9, harness Harness.39S
(unnamed): sheet AMS_slave3/Cell8, harness Harness.38S
(unnamed): sheet AMS_slave3/Cell7, harness Harness.37S
(unnamed): sheet AMS_slave3/Cell6, harness Harness.36S
(unnamed): sheet AMS_slave3/Cell5, harness Harness.35S
(unnamed): sheet AMS_slave3/Cell4, harness Harness.34S
(unnamed): sheet AMS_slave3/Cell3, harness Harness.33S
(unnamed): sheet AMS_slave3/Cell2, harness Harness.32S
(unnamed): sheet AMS_slave3/Cell1, harness Harness.31S

Not connected (* = marked no-connect by the designer): *11 1(B+) 2(B-) 3(VOLT) 4(TEMP); HTFS_1 1(5V) 2(GND) 3(SIGNAL) 4(VREF)

## Sheet LowVoltageBox.SchDoc
size A1
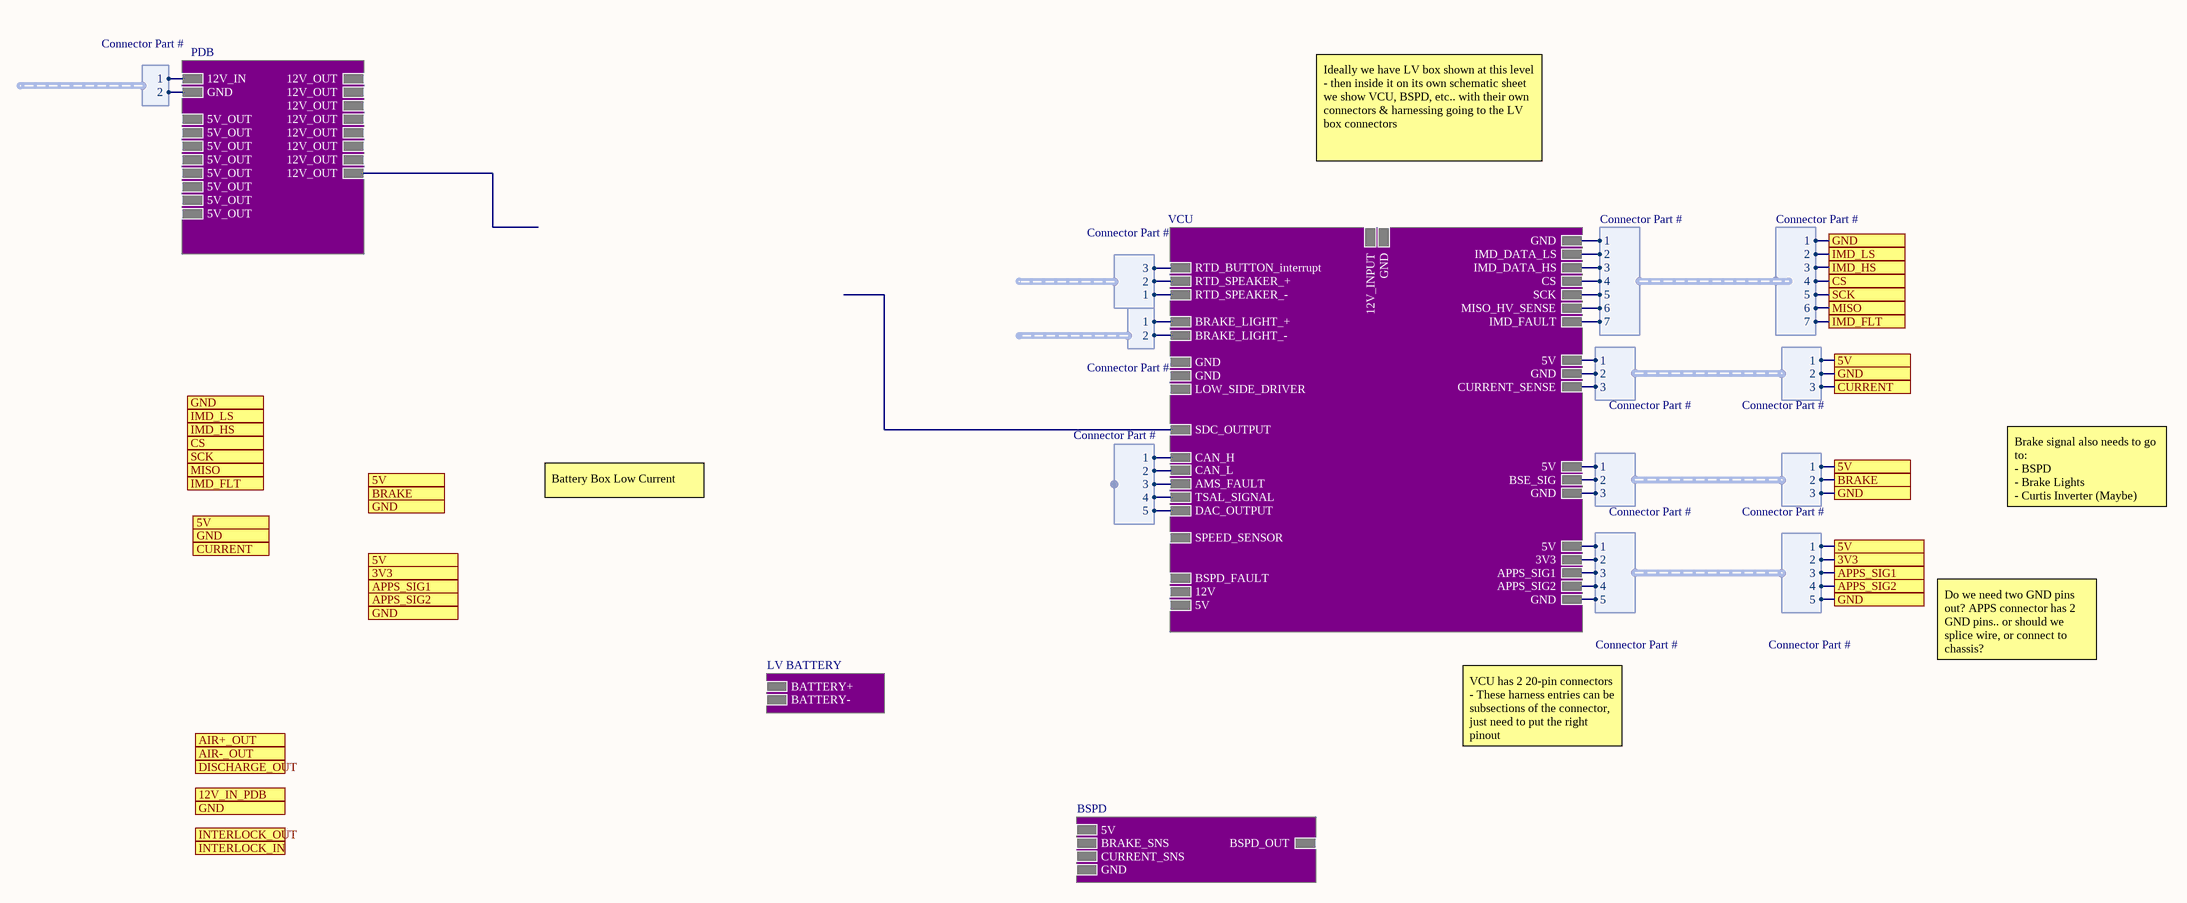
[diagram p8: LowVoltageBox.SchDoc]

### Sub-sheets
BSPD = ?: GND, BRAKE_SNS, CURRENT_SNS, 5V, BSPD_OUT
LV BATTERY = ?: BATTERY-, BATTERY+
PDB = ?: 12V_IN, GND, 12V_OUT, 12V_OUT, 12V_OUT, 12V_OUT, 12V_OUT, 12V_OUT, 12V_OUT, 5V_OUT, 5V_OUT, 5V_OUT, 5V_OUT, 5V_OUT, 12V_OUT, 5V_OUT, 5V_OUT, 5V_OUT
VCU = ?: BRAKE_LIGHT_+, BRAKE_LIGHT_-, 5V, 12V, GND, LOW_SIDE_DRIVER, TSAL_SIGNAL, CAN_H, CAN_L, DAC_OUTPUT, SDC_OUTPUT, BSPD_FAULT, AMS_FAULT, IMD_FAULT, IMD_DATA_LS, CS, SCK, MISO_HV_SENSE, GND, CURRENT_SENSE, 5V, IMD_DATA_HS, GND, RTD_SPEAKER_+, RTD_BUTTON_interrupt, 5V, GND, BSE_SIG, 3V3, GND, 5V, APPS_SIG2, APPS_SIG1, 12V_INPUT, GND, RTD_SPEAKER_-, GND, SPEED_SENSOR

### Ports
3V3 (harness Connector Part #), 5V (harness Connector Part #), 12V_IN_PDB (harness Connector Part #), AIR+_OUT (harness Connector Part #), AIR-_OUT (harness Connector Part #), APPS_SIG1 (harness Connector Part #), APPS_SIG2 (harness Connector Part #), BRAKE (harness Connector Part #), CS (harness Connector Part #), CURRENT (harness Connector Part #), DISCHARGE_OUT (harness Connector Part #), GND (harness Connector Part #), IMD_FLT (harness Connector Part #), IMD_HS (harness Connector Part #), IMD_LS (harness Connector Part #), INTERLOCK_IN (harness Connector Part #), INTERLOCK_OUT (harness Connector Part #), MISO (harness Connector Part #), SCK (harness Connector Part #)

### Harnesses
Connector Part #: 1, 2, 3, 4, 5
Connector Part #: 5, 4, 3, 2, 1
Connector Part #: 1, 2, 3
Connector Part #: 3, 2, 1
Connector Part #: 1, 2, 3, 4, 5, 6, 7
Connector Part #: 7, 6, 5, 4, 3, 2, 1
Connector Part #: 1, 2

### Nets
(unnamed): sheet VCU/BRAKE_LIGHT_+, harness Connector Part #.1
(unnamed): sheet VCU/BRAKE_LIGHT_-, harness Connector Part #.2
(unnamed): sheet VCU/TSAL_SIGNAL, harness Connector Part #.4
(unnamed): sheet VCU/CAN_H, harness Connector Part #.1
(unnamed): sheet VCU/CAN_L, harness Connector Part #.2
(unnamed): sheet VCU/DAC_OUTPUT, harness Connector Part #.5
(unnamed): sheet VCU/AMS_FAULT, harness Connector Part #.3
(unnamed): sheet VCU/IMD_FAULT, harness Connector Part #.7
(unnamed): sheet VCU/IMD_DATA_LS, harness Connector Part #.2
(unnamed): sheet VCU/CS, harness Connector Part #.4
(unnamed): sheet VCU/SCK, harness Connector Part #.5
(unnamed): sheet VCU/MISO_HV_SENSE, harness Connector Part #.6
(unnamed): sheet VCU/GND, harness Connector Part #.1
(unnamed): sheet VCU/CURRENT_SENSE, harness Connector Part #.3
(unnamed): sheet VCU/5V, harness Connector Part #.1
(unnamed): sheet VCU/IMD_DATA_HS, harness Connector Part #.3
(unnamed): sheet VCU/GND, harness Connector Part #.2
(unnamed): sheet VCU/RTD_SPEAKER_+, harness Connector Part #.2
(unnamed): sheet VCU/RTD_BUTTON_interrupt, harness Connector Part #.3
(unnamed): sheet VCU/5V, harness Connector Part #.1
(unnamed): sheet VCU/GND, harness Connector Part #.3
(unnamed): sheet VCU/BSE_SIG, harness Connector Part #.2
(unnamed): sheet VCU/3V3, harness Connector Part #.2
(unnamed): sheet VCU/GND, harness Connector Part #.5
(unnamed): sheet VCU/5V, harness Connector Part #.1
(unnamed): sheet VCU/APPS_SIG2, harness Connector Part #.4
(unnamed): sheet VCU/APPS_SIG1, harness Connector Part #.3
(unnamed): sheet VCU/RTD_SPEAKER_-, harness Connector Part #.1
(unnamed): sheet PDB/12V_IN, harness Connector Part #.1
(unnamed): sheet PDB/GND, harness Connector Part #.2

### Notes on the sheet
- Ideally we have LV box shown at this level
  - then inside it on its own schematic sheet we show VCU, BSPD, etc.. with their own connectors & harnessing going to the LV box connectors
- Battery Box Low Current
- Brake signal also needs to go to:
  - BSPD
  - Brake Lights
  - Curtis Inverter (Maybe)
- Do we need two GND pins out? APPS connector has 2 GND pins.. or should we splice wire, or connect to chassis?
- VCU has 2 20-pin connectors
  - These harness entries can be subsections of the connector, just need to put the right pinout

## Sheet Dashboard.SchDoc
size A1

## Sheet BatteryBoxRight.SchDoc
size A1
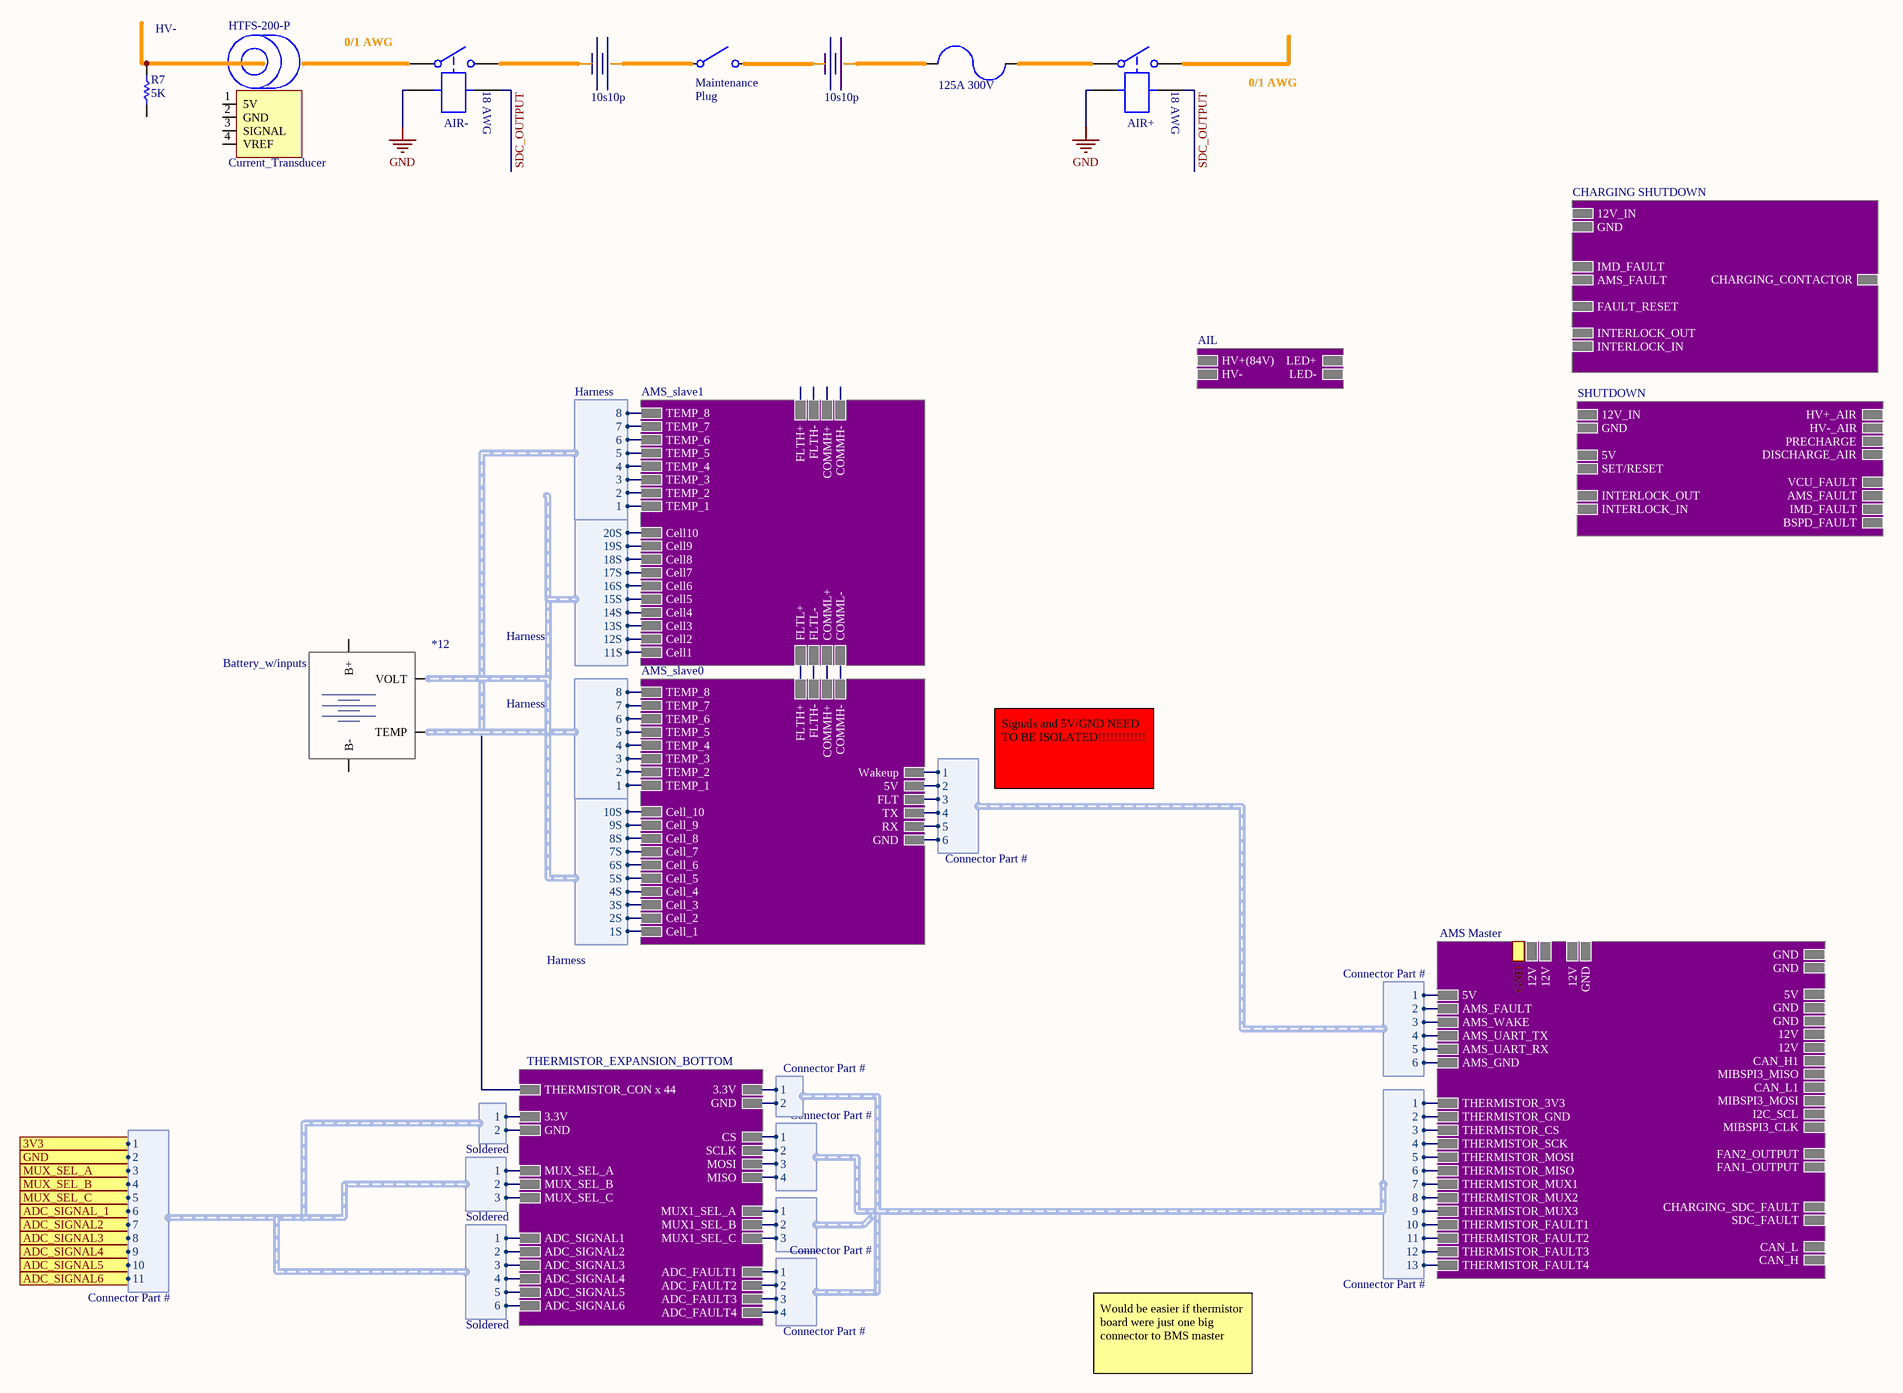
[diagram p9: BatteryBoxRight.SchDoc]

### Parts
10  AIR-
12  125A 300V
13  AIR+
*12  Battery_w/inputs
HTFS-200-P  Current_Transducer
N/A  10s10p
N/A1  10s10p
Plug4  Maintenance_Plug  (value not drawn)
R7  5K

### Sub-sheets
AIL = ?: HV+(84V), HV-, LED+, LED-
AMS Master = ?: 12V, 12V, GND, THERMISTOR_GND, THERMISTOR_3V3, THERMISTOR_FAULT4, THERMISTOR_FAULT3, THERMISTOR_FAULT2, THERMISTOR_FAULT1, THERMISTOR_MUX3, THERMISTOR_MUX2, THERMISTOR_MUX1, THERMISTOR_SCK, THERMISTOR_MISO, AMS_UART_TX, THERMISTOR_MOSI, AMS_UART_RX, THERMISTOR_CS, AMS_FAULT, AMS_WAKE, GND, GND, 5V, 5V, GND, GND, 12V, 12V, CAN_H1, MIBSPI3_MISO, CAN_L1, MIBSPI3_MOSI, I2C_SCL, MIBSPI3_CLK, FAN2_OUTPUT, FAN1_OUTPUT, CHARGING_SDC_FAULT, SDC_FAULT, CAN_L, CAN_H, 12V, GND, AMS_GND
AMS_slave0 = ?: Cell_10, Cell_9, Cell_8, Cell_7, Cell_6, Cell_5, Cell_4, Cell_3, Cell_2, Cell_1, FLTH+, FLTH-, COMMH+, COMMH-, FLT, RX, TX, GND, Wakeup, TEMP_1, TEMP_3, TEMP_4, TEMP_5, TEMP_6, TEMP_7, TEMP_8, TEMP_2, 5V
AMS_slave1 = ?: Cell10, Cell9, Cell8, Cell7, Cell6, Cell5, Cell4, Cell3, Cell2, Cell1, FLTH+, FLTH-, COMMH+, COMMH-, FLTL+, FLTL-, COMML+, COMML-, TEMP_1, TEMP_3, TEMP_4, TEMP_5, TEMP_6, TEMP_7, TEMP_8, TEMP_2
CHARGING SHUTDOWN = ?: 12V_IN, GND, IMD_FAULT, AMS_FAULT, FAULT_RESET, CHARGING_CONTACTOR, INTERLOCK_OUT, INTERLOCK_IN
SHUTDOWN = ?: 12V_IN, GND, DISCHARGE_AIR, PRECHARGE, IMD_FAULT, AMS_FAULT, BSPD_FAULT, SET/RESET, VCU_FAULT, HV+_AIR, HV-_AIR, INTERLOCK_OUT, INTERLOCK_IN, 5V
THERMISTOR_EXPANSION_BOTTOM = ?: CS, SCLK, MOSI, MISO, 3.3V, GND, MUX1_SEL_A, MUX1_SEL_B, MUX1_SEL_C, ADC_FAULT2, ADC_FAULT3, ADC_FAULT4, THERMISTOR_CON x 44, ADC_FAULT1, 3.3V, GND, MUX_SEL_A, MUX_SEL_B, ADC_SIGNAL6, ADC_SIGNAL5, ADC_SIGNAL4, ADC_SIGNAL3, ADC_SIGNAL2, ADC_SIGNAL1, MUX_SEL_C

### Ports
3V3 (harness Connector Part #), ADC_SIGNAL2 (harness Connector Part #), ADC_SIGNAL3 (harness Connector Part #), ADC_SIGNAL4 (harness Connector Part #), ADC_SIGNAL5 (harness Connector Part #), ADC_SIGNAL6 (harness Connector Part #), ADC_SIGNAL_1 (harness Connector Part #), GND (harness Connector Part #), MUX_SEL_A (harness Connector Part #), MUX_SEL_B (harness Connector Part #), MUX_SEL_C (harness Connector Part #)

### Harnesses
Harness: 20S, 19S, 18S, 17S, 16S, 15S, 14S, 13S, 12S, 11S
Harness: 10S, 9S, 8S, 7S, 6S, 5S, 4S, 3S, 2S, 1S
Harness: 1, 2, 3, 4, 5, 6, 7, 8
Connector Part #: 1, 2, 3, 4, 5, 6, 7, 8, 9, 10, 11, 12, 13
Connector Part #: 1, 2, 3, 4
Connector Part #: 1, 2
Connector Part #: 1, 2, 3
Connector Part #: 1, 2, 3, 4, 5, 6
Connector Part #: 6, 5, 4, 3, 2, 1
Soldered: 2, 1
Soldered: 3, 2, 1
Soldered: 6, 5, 4, 3, 2, 1
Connector Part #: 6, 7, 8, 9, 10, 11, 5, 4, 3, 2, 1

### Nets
GND: 10.4 13.4
SDC_OUTPUT: 10.4 13.4
Net10_4: 10.4 N/A1.2
Net12_1: 12.1 N/A.1
Net12_2: 12.2 13.4
Net*12_4: *12.4(TEMP) ; sheet THERMISTOR_EXPANSION_BOTTOM/THERMISTOR_CON x 44
NetN/A1_1: N/A1.1 Plug4.4
NetN/A_2: N/A.2 Plug4.4
(unnamed): sheet AMS_slave0/Cell_10, harness Harness.10S
(unnamed): sheet AMS_slave0/Cell_9, harness Harness.9S
(unnamed): sheet AMS_slave0/Cell_8, harness Harness.8S
(unnamed): sheet AMS_slave0/Cell_7, harness Harness.7S
(unnamed): sheet AMS_slave0/Cell_6, harness Harness.6S
(unnamed): sheet AMS_slave0/Cell_5, harness Harness.5S
(unnamed): sheet AMS_slave0/Cell_4, harness Harness.4S
(unnamed): sheet AMS_slave0/Cell_3, harness Harness.3S
(unnamed): sheet AMS_slave0/Cell_2, harness Harness.2S
(unnamed): sheet AMS_slave0/Cell_1, harness Harness.1S
(unnamed): sheet AMS_slave0/FLTH+, sheet AMS_slave1/FLTL+
(unnamed): sheet AMS_slave0/FLTH-, sheet AMS_slave1/FLTL-
(unnamed): sheet AMS_slave0/COMMH+, sheet AMS_slave1/COMML+
(unnamed): sheet AMS_slave0/COMMH-, sheet AMS_slave1/COMML-
(unnamed): sheet AMS_slave0/FLT, sheet AMS Master/AMS_WAKE, harness Connector Part #.3
(unnamed): sheet AMS_slave0/RX, sheet AMS Master/AMS_UART_RX, harness Connector Part #.5
(unnamed): sheet AMS_slave0/TX, sheet AMS Master/AMS_UART_TX, harness Connector Part #.4
(unnamed): sheet AMS_slave0/GND, sheet AMS Master/AMS_GND, harness Connector Part #.6
(unnamed): sheet AMS_slave0/Wakeup, sheet AMS Master/5V, harness Connector Part #.1
(unnamed): sheet AMS_slave0/TEMP_1, sheet AMS_slave1/TEMP_1, harness Harness.1
(unnamed): sheet AMS_slave0/TEMP_3, sheet AMS_slave1/TEMP_3, harness Harness.3
(unnamed): sheet AMS_slave0/TEMP_4, sheet AMS_slave1/TEMP_4, harness Harness.4
(unnamed): sheet AMS_slave0/TEMP_5, sheet AMS_slave1/TEMP_5, harness Harness.5
(unnamed): sheet AMS_slave0/TEMP_6, sheet AMS_slave1/TEMP_6, harness Harness.6
(unnamed): sheet AMS_slave0/TEMP_7, sheet AMS_slave1/TEMP_7, harness Harness.7
(unnamed): sheet AMS_slave0/TEMP_8, sheet AMS_slave1/TEMP_8, harness Harness.8
(unnamed): sheet AMS_slave0/TEMP_2, sheet AMS_slave1/TEMP_2, harness Harness.2
(unnamed): sheet AMS_slave0/5V, sheet AMS Master/AMS_FAULT, harness Connector Part #.2
(unnamed): sheet AMS_slave1/Cell10, harness Harness.20S
(unnamed): sheet AMS_slave1/Cell9, harness Harness.19S
(unnamed): sheet AMS_slave1/Cell8, harness Harness.18S
(unnamed): sheet AMS_slave1/Cell7, harness Harness.17S
(unnamed): sheet AMS_slave1/Cell6, harness Harness.16S
(unnamed): sheet AMS_slave1/Cell5, harness Harness.15S
(unnamed): sheet AMS_slave1/Cell4, harness Harness.14S
(unnamed): sheet AMS_slave1/Cell3, harness Harness.13S
(unnamed): sheet AMS_slave1/Cell2, harness Harness.12S
(unnamed): sheet AMS_slave1/Cell1, harness Harness.11S
(unnamed): sheet THERMISTOR_EXPANSION_BOTTOM/CS, sheet THERMISTOR_EXPANSION_BOTTOM/3.3V, sheet THERMISTOR_EXPANSION_BOTTOM/MUX1_SEL_A, sheet THERMISTOR_EXPANSION_BOTTOM/ADC_FAULT1, sheet AMS Master/THERMISTOR_3V3, harness Connector Part #.1
(unnamed): sheet THERMISTOR_EXPANSION_BOTTOM/SCLK, sheet THERMISTOR_EXPANSION_BOTTOM/GND, sheet THERMISTOR_EXPANSION_BOTTOM/MUX1_SEL_B, sheet THERMISTOR_EXPANSION_BOTTOM/ADC_FAULT2, sheet AMS Master/THERMISTOR_GND, harness Connector Part #.2
(unnamed): sheet THERMISTOR_EXPANSION_BOTTOM/MOSI, sheet THERMISTOR_EXPANSION_BOTTOM/MUX1_SEL_C, sheet THERMISTOR_EXPANSION_BOTTOM/ADC_FAULT3, sheet AMS Master/THERMISTOR_CS, harness Connector Part #.3
(unnamed): sheet THERMISTOR_EXPANSION_BOTTOM/MISO, sheet THERMISTOR_EXPANSION_BOTTOM/ADC_FAULT4, sheet AMS Master/THERMISTOR_SCK, harness Connector Part #.4
(unnamed): sheet THERMISTOR_EXPANSION_BOTTOM/3.3V, sheet THERMISTOR_EXPANSION_BOTTOM/MUX_SEL_A, sheet THERMISTOR_EXPANSION_BOTTOM/ADC_SIGNAL1, harness Soldered.1, harness Connector Part #.1
(unnamed): sheet THERMISTOR_EXPANSION_BOTTOM/GND, sheet THERMISTOR_EXPANSION_BOTTOM/MUX_SEL_B, sheet THERMISTOR_EXPANSION_BOTTOM/ADC_SIGNAL2, harness Soldered.2, harness Connector Part #.2
(unnamed): sheet THERMISTOR_EXPANSION_BOTTOM/ADC_SIGNAL6, harness Soldered.6, harness Connector Part #.6
(unnamed): sheet THERMISTOR_EXPANSION_BOTTOM/ADC_SIGNAL5, harness Soldered.5, harness Connector Part #.5
(unnamed): sheet THERMISTOR_EXPANSION_BOTTOM/ADC_SIGNAL4, harness Soldered.4, harness Connector Part #.4
(unnamed): sheet THERMISTOR_EXPANSION_BOTTOM/ADC_SIGNAL3, sheet THERMISTOR_EXPANSION_BOTTOM/MUX_SEL_C, harness Soldered.3, harness Connector Part #.3
(unnamed): sheet AMS Master/THERMISTOR_FAULT4, harness Connector Part #.13
(unnamed): sheet AMS Master/THERMISTOR_FAULT3, harness Connector Part #.12
(unnamed): sheet AMS Master/THERMISTOR_FAULT2, harness Connector Part #.11
(unnamed): sheet AMS Master/THERMISTOR_FAULT1, harness Connector Part #.10
(unnamed): sheet AMS Master/THERMISTOR_MUX3, harness Connector Part #.9
(unnamed): sheet AMS Master/THERMISTOR_MUX2, harness Connector Part #.8
(unnamed): sheet AMS Master/THERMISTOR_MUX1, harness Connector Part #.7
(unnamed): sheet AMS Master/THERMISTOR_MISO, harness Connector Part #.6
(unnamed): sheet AMS Master/THERMISTOR_MOSI, harness Connector Part #.5

Not connected (* = marked no-connect by the designer): *12 1(B+) 2(B-) 3(VOLT); HTFS-200-P 1(5V) 2(GND) 3(SIGNAL) 4(VREF); R7 1 2

### Notes on the sheet
- (near R7) HV-
- (near 10) 0/1 AWG
- (near 10) 18 AWG
- (near Plug4) Maintenance
- (near Plug4) Plug
- (near 13) 18 AWG
- 0/1 AWG
- Signals and 5V/GND NEED TO BE ISOLATED!!!!!!!!!!!!
- Would be easier if thermistor board were just one big connector to BMS master

### Library data of the parts
10 13 = AIR_Detailed
12 = FUSE
N/A N/A1 = Battery_Half
R7 = RES

## Nets that join several sheets
GND: Accumulator_Overview (9 pins), ChargingTS (11.4 ?#1.4), BatteryBoxRight (10.4 13.4)